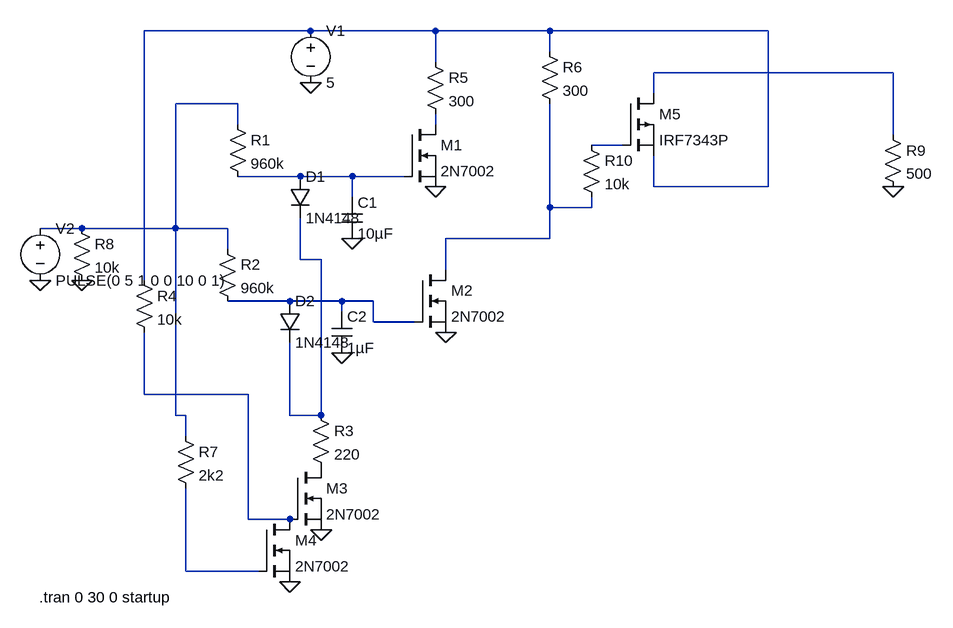
[diagram p0: schematic PreampPSU.asc]
PreampPSU.asc, the LTspice schematic file:
Version 4
SHEET 1 932 888
WIRE -32 0 -288 0
WIRE 160 0 -32 0
WIRE 336 0 160 0
WIRE 672 0 336 0
WIRE 336 32 336 0
WIRE 160 48 160 0
WIRE 864 64 496 64
WIRE 496 96 496 64
WIRE -144 112 -240 112
WIRE -144 144 -144 112
WIRE 160 144 160 128
WIRE 864 160 864 64
WIRE 448 176 400 176
WIRE -48 224 -144 224
WIRE 32 224 -48 224
WIRE 112 224 32 224
WIRE 496 240 496 192
WIRE 672 240 672 0
WIRE 672 240 496 240
WIRE 32 256 32 224
WIRE 336 272 336 112
WIRE 400 272 400 256
WIRE 400 272 336 272
WIRE -384 304 -448 304
WIRE -240 304 -240 112
WIRE -240 304 -384 304
WIRE -160 304 -240 304
WIRE 336 320 336 272
WIRE 336 320 176 320
WIRE -160 336 -160 304
WIRE -48 352 -48 288
WIRE -16 352 -48 352
WIRE 176 368 176 320
WIRE -288 384 -288 0
WIRE -64 416 -160 416
WIRE 16 416 -64 416
WIRE 64 416 16 416
WIRE 16 432 16 416
WIRE 64 448 64 416
WIRE 128 448 64 448
WIRE -288 560 -288 464
WIRE -128 560 -288 560
WIRE -240 592 -240 304
WIRE -224 592 -240 592
WIRE -64 592 -64 480
WIRE -16 592 -16 352
WIRE -16 592 -64 592
WIRE -224 624 -224 592
WIRE -128 752 -128 560
WIRE -64 752 -128 752
WIRE -224 832 -224 704
WIRE -112 832 -224 832
FLAG 160 240 0
FLAG 32 320 0
FLAG 16 496 0
FLAG 176 464 0
FLAG -16 768 0
FLAG -64 848 0
FLAG -384 384 0
FLAG -32 80 0
FLAG -448 384 0
FLAG 864 240 0
SYMBOL nmos 112 144 R0
SYMATTR InstName M1
SYMATTR Value 2N7002
SYMBOL res -160 128 R0
SYMATTR InstName R1
SYMATTR Value 960k
SYMBOL cap 16 256 R0
SYMATTR InstName C1
SYMATTR Value 10µF
SYMBOL res -176 320 R0
SYMATTR InstName R2
SYMATTR Value 960k
SYMBOL cap 0 432 R0
SYMATTR InstName C2
SYMATTR Value 1µF
SYMBOL nmos 128 368 R0
SYMATTR InstName M2
SYMATTR Value 2N7002
SYMBOL diode -64 224 R0
SYMATTR InstName D1
SYMATTR Value 1N4148
SYMBOL diode -80 416 R0
SYMATTR InstName D2
SYMATTR Value 1N4148
SYMBOL res -32 576 R0
SYMATTR InstName R3
SYMATTR Value 220
SYMBOL nmos -64 672 R0
SYMATTR InstName M3
SYMATTR Value 2N7002
SYMBOL nmos -112 752 R0
SYMATTR InstName M4
SYMATTR Value 2N7002
SYMBOL res -304 368 R0
SYMATTR InstName R4
SYMATTR Value 10k
SYMBOL res 144 32 R0
SYMATTR InstName R5
SYMATTR Value 300
SYMBOL res 320 16 R0
SYMATTR InstName R6
SYMATTR Value 300
SYMBOL res -240 608 R0
SYMATTR InstName R7
SYMATTR Value 2k2
SYMBOL res -400 288 R0
SYMATTR InstName R8
SYMATTR Value 10k
SYMBOL voltage -32 -16 R0
WINDOW 123 0 0 Left 2
WINDOW 39 0 0 Left 2
SYMATTR InstName V1
SYMATTR Value 5
SYMBOL voltage -448 288 R0
WINDOW 123 0 0 Left 2
WINDOW 39 0 0 Left 2
SYMATTR InstName V2
SYMATTR Value PULSE(0 5 1 0 0 10 0 1)
SYMBOL pmos 448 96 R0
SYMATTR InstName M5
SYMATTR Value IRF7343P
SYMBOL res 848 144 R0
SYMATTR InstName R9
SYMATTR Value 500
SYMBOL res 384 160 R0
SYMATTR InstName R10
SYMATTR Value 10k
TEXT -450 872 Left 2 !.tran 0 30 0 startup

The netlist it stands for:
* PreampPSU.asc
M1 N004 N006 0 0 2N7002
R1 N003 N006 960k
C1 N006 0 10µF
R2 N003 N009 960k
C2 N009 0 1µF
M2 N007 N009 0 0 2N7002
D1 N006 N008 1N4148
D2 N009 N008 1N4148
R3 N008 P001 220
M3 P001 N010 0 0 2N7002
M4 N010 N011 0 0 2N7002
R4 N001 N010 10k
R5 N001 N004 300
R6 N001 N007 300
R7 N003 N011 2k2
R8 N003 0 10k
V1 N001 0 5
V2 N003 0 PULSE(0 5 1 0 0 10 0 1)
M5 N002 N005 N001 N001 IRF7343P
R9 N002 0 500
R10 N005 N007 10k
.model D D
.lib standard.dio
.model NMOS NMOS
.model PMOS PMOS
.lib standard.mos
.tran 0 30 0 startup
.backanno
.end